# Altium project DEV_board_project.PrjPcb
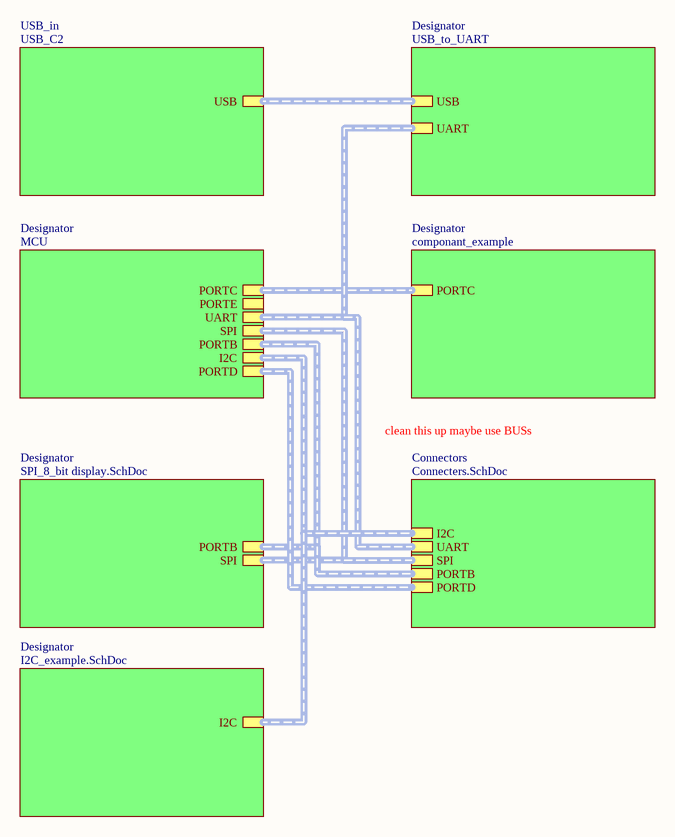
[diagram p0: example connect.SchDoc]
8 sheets, 64 parts. Net scope: hierarchical (ports join the sheet entries above them; power ports are global).
Board file: DEV_board_PCB.PcbDoc
Sheets:
  example connect.SchDoc
    Designator = MCU.SchDoc
    Designator = componant_example.SchDoc
    USB_in = USB_C2.SchDoc
    Designator = USB_to_UART.SchDoc
    Designator = SPI_8_bit display.SchDoc
    Connectors = Connecters.SchDoc
    Designator = I2C_example.SchDoc

## Sheet example connect.SchDoc
size A4; SheetNumber: 1; SheetTotal: 8

### Sub-sheets
Connectors = Connecters.SchDoc: I2C (harness I2C), UART (harness UART), SPI (harness SPI), PORTB (harness PORTB), PORTD (harness PORTD)
Designator = MCU: PORTC (harness PORTC), PORTE (harness PORTE), UART (harness UART), SPI (harness SPI), PORTB (harness PORTB), I2C (harness I2C), PORTD (harness PORTD)
Designator = componant_example: PORTC (harness PORTC)
Designator = USB_to_UART: USB (harness USB), UART (harness UART)
Designator = SPI_8_bit display.SchDoc: SPI (harness SPI), PORTB (harness PORTB)
Designator = I2C_example.SchDoc: I2C (harness I2C)
USB_in = USB_C2: USB (harness USB)

### Buses and harness runs
harness sheet Connectors/I2C = sheet Designator/I2C
harness sheet Connectors/PORTB = sheet Designator/PORTB
harness sheet Connectors/PORTD = sheet Designator/PORTD
harness sheet Connectors/SPI = sheet Designator/SPI
harness sheet Connectors/UART = sheet Designator/UART
harness sheet Designator/USB = sheet USB_in/USB

### Notes on the sheet
- clean this up maybe use BUSs

## Sheet MCU.SchDoc
size A3; SheetNumber: 2; SheetTotal: 8
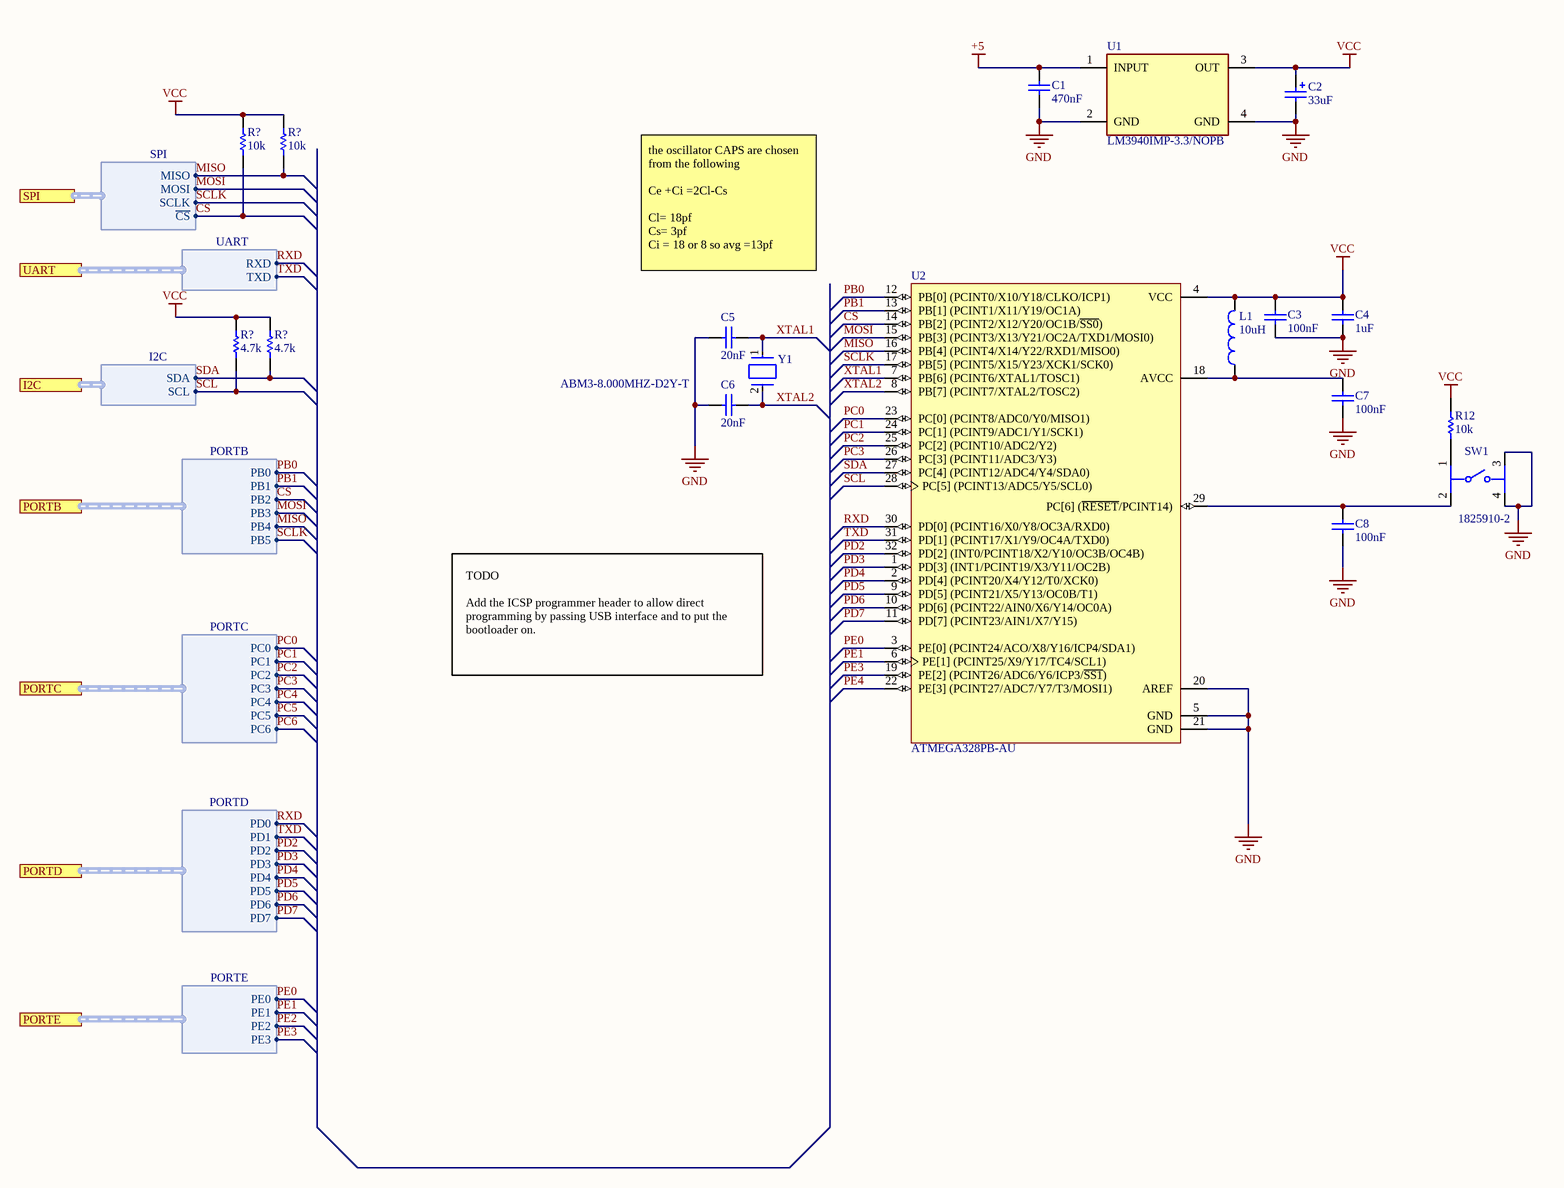
[diagram p1: MCU.SchDoc]

### Parts
(Parts that share a designator on the sheet are numbered #1, #2 ... from top to bottom, then left to right.)
C1  470nF
C2  33uF
C3  100nF
C4  1uF
C5  20nF
C6  20nF
C7  100nF
C8  100nF
L1  10uH  [0402-A]
R12  10k
R?#1  10k
R?#2  10k
R?#3  4.7k
R?#4  4.7k
SW1  1825910-2  [FP-1825910-2-0]
U1  LM3940IMP-3.3/NOPB  [FP-DCY0004A-MFG]
U2  ATMEGA328PB-AU  [ATML-32A_M]
Y1  ABM3-8.000MHZ-D2Y-T  [FP-ABM3-MFG]

### Ports
I2C (harness I2C), PORTB (harness PORTB), PORTC (harness PORTC), PORTD (harness PORTD), PORTE (harness PORTE), SPI (harness SPI), UART (harness UART)

### Harnesses
SPI: MISO, MOSI, SCLK, ~{CS}
UART: RXD, TXD
I2C: SDA, SCL
PORTB: PB0, PB1, PB2, PB3, PB4, PB5
PORTC: PC0, PC1, PC2, PC3, PC4, PC5, PC6
PORTD: PD0, PD1, PD2, PD3, PD4, PD5, PD6, PD7
PORTE: PE0, PE1, PE2, PE3

### Nets
+5: C1.2 U1.1(INPUT)
GND: C1.1 C2.2 C3.1 C4.1 C5.2 C6.2 C7.1 C8.1 SW1.3 SW1.4 U1.2(GND) U1.4(GND) U2.5(GND) U2.20(AREF) U2.21(GND)
VCC: C2.1 C3.2 C4.2 L1.2 R12.2 R?#1.2 R?#2.2 R?#3.2 R?#4.2 U1.3(OUT) U2.4(VCC)
~{CS}: R?#1.1 U2.14(PB[2]_(PCINT2/X12/Y20/OC1B/~{SS0})) ; port SPI.~{CS}
CS: U2.13(PB[1]_(PCINT1/X11/Y19/OC1A)) ; port PORTB.PB1, port PORTB.PB2  [also labelled PB1]
MISO: R?#2.1 U2.16(PB[4]_(PCINT4/X14/Y22/RXD1/MISO0)) ; port SPI.MISO, port PORTB.PB4
MOSI: U2.15(PB[3]_(PCINT3/X13/Y21/OC2A/TXD1/MOSI0)) ; port SPI.MOSI, port PORTB.PB3
PB0: U2.12(PB[0]_(PCINT0/X10/Y18/CLKO/ICP1)) ; port PORTB.PB0  [project net CS]
PC0: U2.23(PC[0]_(PCINT8/ADC0/Y0/MISO1)) ; port PORTC.PC0
PC1: U2.24(PC[1]_(PCINT9/ADC1/Y1/SCK1)) ; port PORTC.PC1
PC2: U2.25(PC[2]_(PCINT10/ADC2/Y2)) ; port PORTC.PC2
PC3: U2.26(PC[3]_(PCINT11/ADC3/Y3)) ; port PORTC.PC3
PC4: port PORTC.PC4
PC5: port PORTC.PC5
PC6: port PORTC.PC6
PD2: U2.32(PD[2]_(INT0/PCINT18/X2/Y10/OC3B/OC4B)) ; port PORTD.PD2
PD3: U2.1(PD[3]_(INT1/PCINT19/X3/Y11/OC2B)) ; port PORTD.PD3
PD4: U2.2(PD[4]_(PCINT20/X4/Y12/T0/XCK0)) ; port PORTD.PD4
PD5: U2.9(PD[5]_(PCINT21/X5/Y13/OC0B/T1)) ; port PORTD.PD5
PD6: U2.10(PD[6]_(PCINT22/AIN0/X6/Y14/OC0A)) ; port PORTD.PD6
PD7: U2.11(PD[7]_(PCINT23/AIN1/X7/Y15)) ; port PORTD.PD7
PE0: U2.3(PE[0]_(PCINT24/ACO/X8/Y16/ICP4/SDA1)) ; port PORTE.PE0
PE1: U2.6(PE[1]_(PCINT25/X9/Y17/TC4/SCL1)) ; port PORTE.PE1
PE2: port PORTE.PE2
PE3: U2.19(PE[2]_(PCINT26/ADC6/Y6/ICP3/~{SS1})) ; port PORTE.PE3
PE4: U2.22(PE[3]_(PCINT27/ADC7/Y7/T3/MOSI1))
RXD: U2.30(PD[0]_(PCINT16/X0/Y8/OC3A/RXD0)) ; port UART.RXD, port PORTD.PD0
SCL: R?#3.1 U2.28(PC[5]_(PCINT13/ADC5/Y5/SCL0)) ; port I2C.SCL
SCLK: U2.17(PB[5]_(PCINT5/X15/Y23/XCK1/SCK0)) ; port SPI.SCLK, port PORTB.PB5
SDA: R?#4.1 U2.27(PC[4]_(PCINT12/ADC4/Y4/SDA0)) ; port I2C.SDA
TXD: U2.31(PD[1]_(PCINT17/X1/Y9/OC4A/TXD0)) ; port UART.TXD, port PORTD.PD1
XTAL1: C5.1 U2.7(PB[6]_(PCINT6/XTAL1/TOSC1)) Y1.1
XTAL2: C6.1 U2.8(PB[7]_(PCINT7/XTAL2/TOSC2)) Y1.2
NetC7_2: C7.2 L1.1 U2.18(AVCC)
NetC8_2: C8.2 SW1.2 U2.29(PC[6]_(~{RESET}/PCINT14))
NetR12_1: R12.1 SW1.1

### Notes on the sheet
- the oscillator CAPS are chosen from the following
  Ce +Ci =2Cl-Cs
  Cl= 18pf
  Cs= 3pf
  Ci = 18 or 8 so avg =13pf
- TODO
  Add the ICSP programmer header to allow direct programming by passing USB interface and to put the bootloader on.

### Library data of the parts
C1 = 470nF: Capacitor; Published: 8-Jun-2000; LatestRevisionDate: 17-Jul-2002; LatestRevisionNote: Re-released for DXP Platform.; PackageReference: RAD-0.3; Publisher: Altium Limited; PackageDescription: Radial Cap, Thru-Hole; 2 Leads; 0.3 in Pin Spacing
C2 = 33uF: Polarized Capacitor; Published: 8-Jun-2000; LatestRevisionDate: 29-May-2009; LatestRevisionNote: IPC-7351 Footprint Added.; PackageReference: C0805; Publisher: Altium Limited; PackageDescription: Chip Capacitor
C3 C7 C8 = 100nF: Capacitor; Published: 8-Jun-2000; LatestRevisionDate: 17-Jul-2002; LatestRevisionNote: Re-released for DXP Platform.; PackageReference: RAD-0.3; Publisher: Altium Limited; PackageDescription: Radial Cap, Thru-Hole; 2 Leads; 0.3 in Pin Spacing
C4 = 1uF: Capacitor; Published: 8-Jun-2000; LatestRevisionDate: 17-Jul-2002; LatestRevisionNote: Re-released for DXP Platform.; PackageReference: RAD-0.3; Publisher: Altium Limited; PackageDescription: Radial Cap, Thru-Hole; 2 Leads; 0.3 in Pin Spacing
C5 C6 = 20nF: Capacitor; Published: 8-Jun-2000; LatestRevisionDate: 17-Jul-2002; LatestRevisionNote: Re-released for DXP Platform.; PackageReference: RAD-0.3; Publisher: Altium Limited; PackageDescription: Radial Cap, Thru-Hole; 2 Leads; 0.3 in Pin Spacing
L1 = 10uH: Inductor; Code_IEC: 1005; Published: 8-Jun-2000; LatestRevisionDate: 29-May-2009; LatestRevisionNote: IPC-7351 Footprint Added.; PackageReference: 0402-A; Publisher: Altium Limited; PackageDescription: Chip Inductor; Code_JEITA: 0402
R12 R?#1 R?#2 = 10k: Resistor; Published: 8-Jun-2000; LatestRevisionDate: 17-Jul-2002; LatestRevisionNote: Re-released for DXP Platform.; PackageReference: AXIAL-0.3; Publisher: Altium Limited; PackageDescription: Axial Device, Thru-Hole; 2 Leads; 0.3 in Pin Spacing
R?#3 R?#4 = 4.7k: 4.7k Resistor; Published: 8-Jun-2000; LatestRevisionDate: 17-Jul-2002; LatestRevisionNote: Re-released for DXP Platform.; PackageReference: AXIAL-0.3; Publisher: Altium Limited; PackageDescription: Axial Device, Thru-Hole; 2 Leads; 0.3 in Pin Spacing
SW1 = CMP-03407-000004-1: SWITCH TACTILE SPST-NO 0.05A 24V; Manufacturer: TE; Contact Current Rating: 50mA; Operating Force: 160gf; Contact Resistance: 100mΩ; Electromechanical Life: 100000Cycles; Package: 0; ComponentLink2Description: Datasheet; Digikey Description: SWITCH TACTILE SPST-NO 0.05A 24V; Octopart: https://octopart.com/1825910-2-te+connectivity-42270502; Temperature Range Low: -35°C; Temperature Range High: +85°C; Lead Free: Yes; Device Class L2: Switches; Automotive: No; Temperature: -35°C to +85°C; Device Class L1: Electromechanical; Category: Switch; ComponentLink2URL: https://www.te.com/commerce/DocumentDelivery/DDEController?Action=showdoc&DocId=Customer+Drawing%7F1825910%7FC10%7Fpdf%7FEnglish%7FENG_CD_1825910_C10.pdf%7F1825910-2; Mount: Through Hole; RoHS: TRUE; Height: 4.6mm; Manufacturer Part Number: 1825910-2; Device Class L3: Tactile Switches; Voltage Rating Dc: 24V; Throw Configuration: SPST-NO
U1 = CMP-0062-01788-4: IC REG LINEAR 3.3V 1A SOT223-4; Min Input Voltage: 4.5V; Max Supply Voltage: 7.5V; Number of Outputs: 1; Output Type: Fixed; Polarity: Positive; Dropout Voltage: 500mV; Quiescent Current: 15mA; Max Output Voltage: 3.3V; Length: 6.5mm; Termination: SMD/SMT; Width: 3.56mm; Min Supply Voltage: 4.5V; Max Output Current: 1A; Case/Package: SOT-223; Output Voltage: 3.3V; Current Rating: 1A; Packaging: Tape and Reel; Lead Free: Lead Free; Nominal Output Voltage: 3.3V; Height: 1.6mm; Series: -; Output Configuration: Positive; Radiation Hardening: No; Number of Regulators: 1; Package Quantity: 1000; REACH SVHC: No SVHC; Max Input Voltage: 7.5V; Max Operating Temperature: 125°C; Min Operating Temperature: -40°C; Output Current: 1A; Contact Plating: Tin; Number of Pins: 4; Mount: Surface Mount
U2 = CMP-2000-07439-1: AVR Microcontroller, 1.8 to 5.5 V, 32 KB Flash, 1 KB EEPROM, 2 KB SRAM, -40 to 85 degC, 32-Pin TQFP (32A), RoHS, Tray; Manufacturer: Microchip; Datasheet URL: http://ww1.microchip.com/downloads/en/DeviceDoc/40001906A.pdf; Mounting Technology: SurfaceMount; RoHSCompliant: false; Manufacturer URL: http://www.microchip.com/; Package Description: 32-Pin Thin Profile Plastic Quad Flat Package, Body 7 x 7 mm, Pitch 0.8 mm; Package Reference: 32A; Datasheet Version: Rev. A, 04/2017
Y1 = CMP-2000-05033-2: Crystal 8MHz ±20ppm 18pF SMD-2 5mm x 3.2mm; Series Resistance: 500R; Frequency Stability: 30ppm; ESR (Equivalent Series Resistance): 140R; Load Capacitance: 18pF; Height: 0.051inch; Tolerance: 20ppm; Depth: 3.2mm; Max Operating Temperature: 85°C; Frequency: 8MHz; Termination: SMD/SMT; Lead Free: Lead Free; Number of Pins: 2; Width: 3.2mm; RoHS Compliant: Yes; Resistor Type: Ceramic; Length: 5mm; Mount: Surface Mount; Case/Package: CSMD; Package Quantity: 1000; Radiation Hardening: No; Min Operating Temperature: -40°C; Packaging: Tape and Reel; Frequency Tolerance: 20ppm

## Sheet componant_example.SchDoc
size A4; SheetNumber: 5; SheetTotal: 8
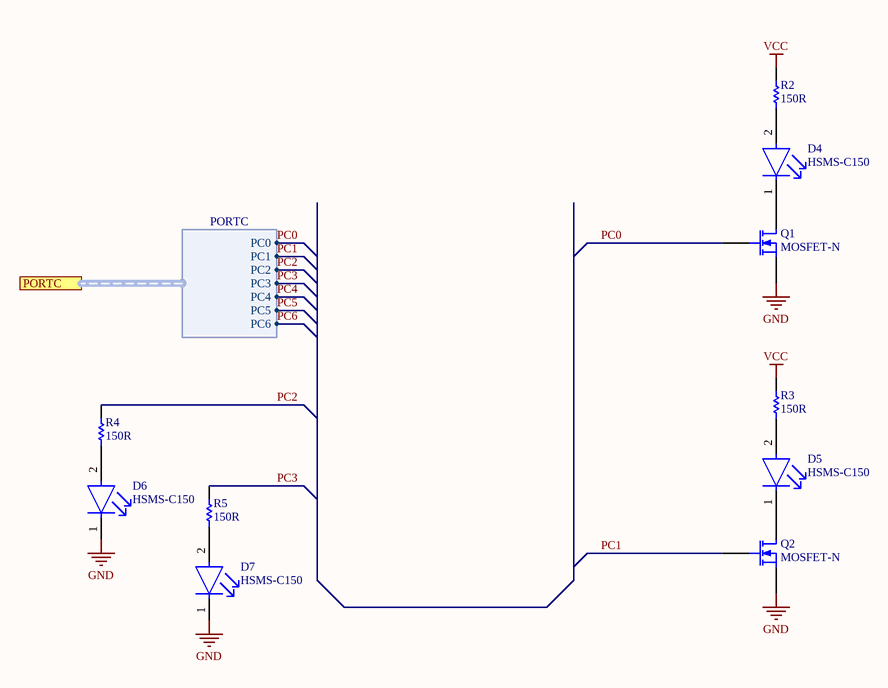
[diagram p2: componant_example.SchDoc]

### Parts
D4  HSMS-C150  [FP-HSMS-C150-MFG]
D5  HSMS-C150  [FP-HSMS-C150-MFG]
D6  HSMS-C150  [FP-HSMS-C150-MFG]
D7  HSMS-C150  [FP-HSMS-C150-MFG]
Q1  MOSFET-N
Q2  MOSFET-N
R2  150R  [RES 0603 SILK]
R3  150R  [RES 0603 SILK]
R4  150R  [RES 0603 SILK]
R5  150R  [RES 0603 SILK]

### Ports
PORTC (harness PORTC)

### Harnesses
PORTC: PC0, PC1, PC2, PC3, PC4, PC5, PC6

### Nets
GND: D6.1(C) D7.1(C) Q1.3(S) Q2.3(S)
VCC: R2.2 R3.2
PC0: Q1.2(G) ; port PORTC.PC0
PC1: Q2.2(G) ; port PORTC.PC1
PC2: R4.2 ; port PORTC.PC2
PC3: R5.2 ; port PORTC.PC3
PC4: port PORTC.PC4
PC5: port PORTC.PC5
PC6: port PORTC.PC6
NetD4_1: D4.1(C) Q1.1(D)
NetD4_2: D4.2(A) R2.1
NetD5_1: D5.1(C) Q2.1(D)
NetD5_2: D5.2(A) R3.1
NetD6_2: D6.2(A) R4.1
NetD7_2: D7.2(A) R5.1

### Library data of the parts
D4-D7 = CMP-21615-000001-1: LED RED DIFFUSED CHIP SMD; Luminous Intensity: 10mcd; Power Dissipation: 65mW; Viewing Angle: 170°; Number of Elements: 1; Forward Current: 20mA; Lens Color: White; Lens Style: Rectangular; Wavelength: 626nm; Forward Voltage: 2.1V; Reverse Voltage: 5V; Number of Pins: 2; Color: Red; Lead Free: Lead Free; Width: 1.6mm; Length: 3.2mm; REACH SVHC: No SVHC; Height: 1.1mm; Depth: 1.6mm; Power Rating: 65mW; Package Quantity: 1; Illumination Color: Red; Radiation Hardening: No; Case Code (Imperial): 1206; Max Operating Temperature: 85°C; Test Current: 20mA; Case/Package: 1206; Lens Transparency: Diffused; Number of LEDs: 1; Packaging: Tape and Reel; Mount: Surface Mount; Min Operating Temperature: -40°C; Case Code (Metric): 3216; Dominant Wavelength: 626nm
Q1 Q2 = 2N7002: N-Channel MOSFET / 2N7002,215 (SOT23) package; Published: 8-Jun-2000; LatestRevisionDate: 17-Jul-2002; LatestRevisionNote: Re-released for DXP Platform.; PackageVersion: 1995/1996; PackageReference: E3; Publisher: Altium Limited; PackageDescription: TO, Flat Index; 3 In-Line, Axial Leads; Body Dia. 4.6mm; Lead Dia. 0.5 mm (max)
R2-R5 = 150R: Resistor; Published: 8-Jun-2000; LatestRevisionDate: 17-Jul-2002; LatestRevisionNote: Re-released for DXP Platform.; PackageReference: AXIAL-0.3; Publisher: Altium Limited; PackageDescription: Axial Device, Thru-Hole; 2 Leads; 0.3 in Pin Spacing

## Sheet USB_C2.SchDoc
size A4; SheetNumber: 5; SheetTotal: 8
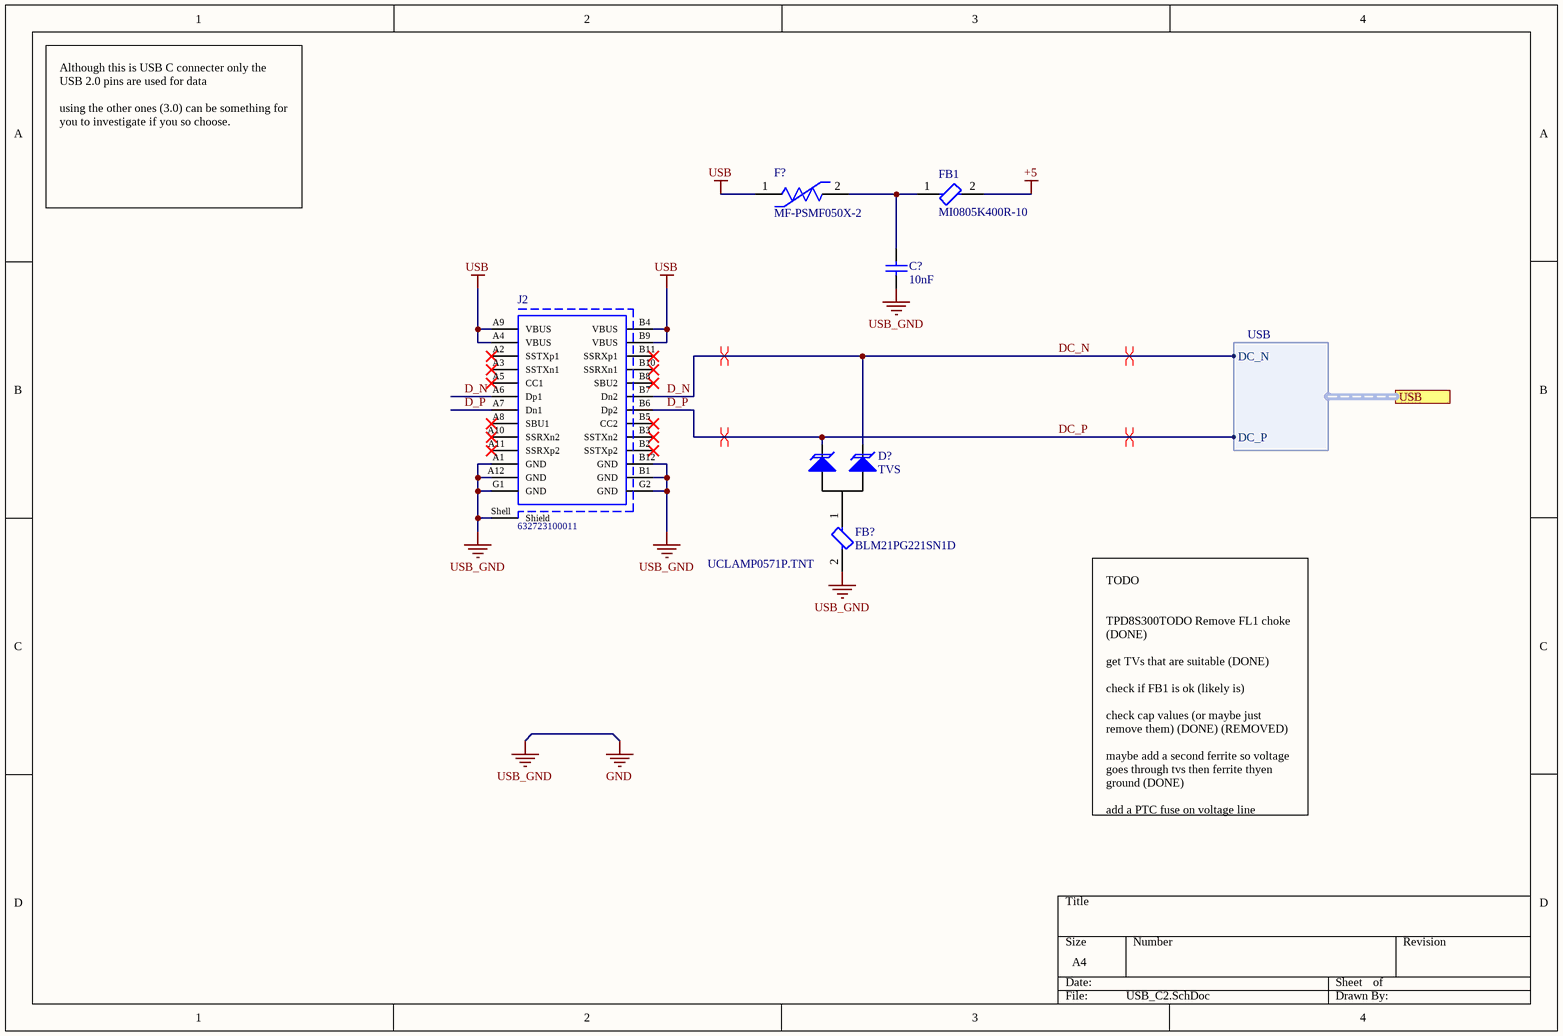
[diagram p3: USB_C2.SchDoc]

### Parts
(Parts that share a designator on the sheet are numbered #1, #2 ... from top to bottom, then left to right.)
C?#1  10nF
D?  TVS  [SOT50P160X90-3N]
F?  MF-PSMF050X-2  [FP-MF-PSMF-MFG]
FB1  MI0805K400R-10  [FP-MI0805-MFG]
FB?  BLM21PG221SN1D  [FP-BLM21-0_2-t0_85-e0_5-IPC_B]
J2  632723100011  [632723100011]

### Ports
USB (harness USB)

### Harnesses
USB: DC_N, DC_P

### Nets
+5: FB1.2
GND: C?#1.1 FB?.2 J2.A1(GND) J2.A12(GND) J2.B1(GND) J2.B12(GND) J2.G1(GND) J2.G2(GND) J2.Shell(Shield)  [also labelled USB_GND]
USB: F?.1 J2.A4(VBUS) J2.A9(VBUS) J2.B4(VBUS) J2.B9(VBUS)
D_N: D?.1 J2.A6(Dp1) J2.B7(Dn2) ; port USB.DC_N  [also labelled DC_N]
D_P: D?.2 J2.A7(Dn1) J2.B6(Dp2) ; port USB.DC_P  [also labelled DC_P]
NetC?#1_2: C?#1.2 F?.2 FB1.1
NetD?_3: D?.3 FB?.1

Not connected (* = marked no-connect by the designer): J2 A2(SSTXp1)* A3(SSTXn1)* A5(CC1)* A8(SBU1)* A10(SSRXn2)* A11(SSRXp2)* B2(SSTXp2)* B3(SSTXn2)* B5(CC2)* B8(SBU2)* B10(SSRXn1)* B11(SSRXp1)*

### Layout directives
differential pair: D_N, D_P

### Notes on the sheet
- Although this is USB C connecter only the USB 2.0 pins are used for data
  using the other ones (3.0) can be something for you to investigate if you so choose.
- UCLAMP0571P.TNT
- TODO
  TPD8S300TODO Remove FL1 choke (DONE)
  get TVs that are suitable (DONE)
  check if FB1 is ok (likely is)
  check cap values (or maybe just remove them) (DONE) (REMOVED)
  maybe add a second ferrite so voltage goes through tvs then ferrite thyen ground (DONE)
  add a PTC fuse on voltage line (DONE)

### Library data of the parts
C?#1 = 10nF: 10nF ceramic Capacitor / (USB 5V smoothing cap); Published: 8-Jun-2000; LatestRevisionDate: 17-Jul-2002; LatestRevisionNote: Re-released for DXP Platform.; PackageReference: RAD-0.3; Publisher: Altium Limited; PackageDescription: Radial Cap, Thru-Hole; 2 Leads; 0.3 in Pin Spacing
D? = TVS combined: dual TVS diode for USB 2.0 protection / RCLAMP0582BQTCT; Supplier 1: Digi-Key; Supplier 2: Digi-Key; Supplier 3: Digi-Key; Supplier 4: Mouser; Supplier Part Number 1: RCLAMP0582BQTCTCT-ND; Supplier Part Number 2: RCLAMP0582BQTCTDKR-ND; Supplier Part Number 3: RCLAMP0582BQTCTTR-ND; Supplier Part Number 4: 947-RCLAMP0582BQTCT
F? = CMP-07400-000013-1: PTC RESET FUSE 6V 500MA 0805; Manufacturer: Bourns Inc.; Trip Current: 1A; Trip Time: 0.1s; Value: 0.15-0.9Ω; Hold Current: 0.5A; Current Rating: 40A; Category: Fuse; Temperature: -40°C to +85°C; ComponentLink2Description: Datasheet; Manufacturer Part Number: MF-PSMF050X-2; Temperature Range High: +85°C; Package: MF-PSMF; Device Class L1: Circuit Protection; Lead Free: Yes; ComponentLink2URL: https://www.bourns.com/docs/product-datasheets/mfpsmf.pdf?sfvrsn=9c05cafe_24; Ambient Temperature Range Low: -40°C; Mouser Description: Resettable Fuses - PPTC .50A 6V 0.15ohm Hold .5 Trip 1; Resistance: 0.15-0.9Ω; Automotive: Yes; Ambient Temperature Range High: +85°C; Device Class L2: PTC Resettable Fuses; Temperature Range Low: -40°C; Device Class L3: unset; Octopart: https://octopart.com/mf-psmf050x-2-bourns-7483438; Digikey Description: PTC RESET FUSE 6V 500MA 0805; Height: 0.85mm; RoHS: TRUE; Voltage Rating: 6V
FB1 = CMP-2000-06702-2: FERRITE BEAD 40 OHM 0805 1LN; Impedance: 40R; Max Current Rating: 1.5A; Tolerance: 25%; Test Frequency: 100MHz; DC Resistance (DCR): 50mR; Number of Lines: 1; Min Operating Temperature: -40°C; Case/Package: 0805; Depth: 1.45mm; Current Rating: 1.5A; Width: 0.049inch; Core Material: Ferrite; Termination: SMD/SMT; Case Code (Imperial): 0805; Packaging: Tape and Reel; Weight: 0.00392oz; Lead Free: Lead Free; Length: 2mm; Max Operating Temperature: 125°C; Mount: Surface Mount; Case Code (Metric): 2012; Frequency: 100MHz; Height: 0.043inch; Package Quantity: 1; Material: Ferrite; Contact Plating: Tin; Max DC Current: 1.5A
FB? = CMP-0686-00610-3: Chip Ferrite Bead, 0805, 220Ω @ 100MHz, 0.045Ω, 25%, 2A; Number of Circuits: 1; Shielding: Unshielded; DC Resistance (DCR): 45mR; Impedance: 220R; Radiation Hardening: No; Material: Ferrite; Frequency: 100MHz; Width: 1.25mm; DC Current: 2A; Max DC Current: 2A; Number of Lines: 1; Package Quantity: 1; Case Code (Metric): 2012; Current Rating: 2A; Case/Package: 0805; Current: 2A; Military Standard: Not; Core Material: Ferrite; Depth: 1.25mm; Contact Plating: Tin; DC Resistance-Max: 45mR; Max Operating Temperature: 125°C; Length: 2mm; Max Current Rating: 2A; REACH SVHC: No SVHC; Termination: SMD/SMT; Min Operating Temperature: -55°C; Series: BLM21P; Test Frequency: 100MHz; Tolerance: 25%; Number of Pins: 2; RoHS Compliant: Yes; Height: 0.85mm; Packaging: Tape and Reel; Lead Free: Lead Free; Case Code (Imperial): 0805
J2 = CMP-1502-03213-1: USB 3.1 Type C Receptacle WR-COM, Horizontal, SMT / THT; Manufacturer: Wurth Elektronik; Working Voltage: 20VDC; Rated Current: 5A; Contact Resistance: 30mOhm; Operating Temperature: -40to105degC; Publisher: WurthElektronik; Gender: Receptacle; Part Number: 632723100011; Mounting Technology: SMT/THT; Datasheet URL: https://katalog.we-online.de/em/datasheet/632723x00011%282%29.pdf; Connector Type: USB3.1TypeC; Manufacturer URL: http://www.we-online.de; Orientation: Horizontal; Package Reference: 632723100011; Packaging: TapeandReel

## Sheet USB_to_UART.SchDoc
size A4; SheetNumber: 6; SheetTotal: 8
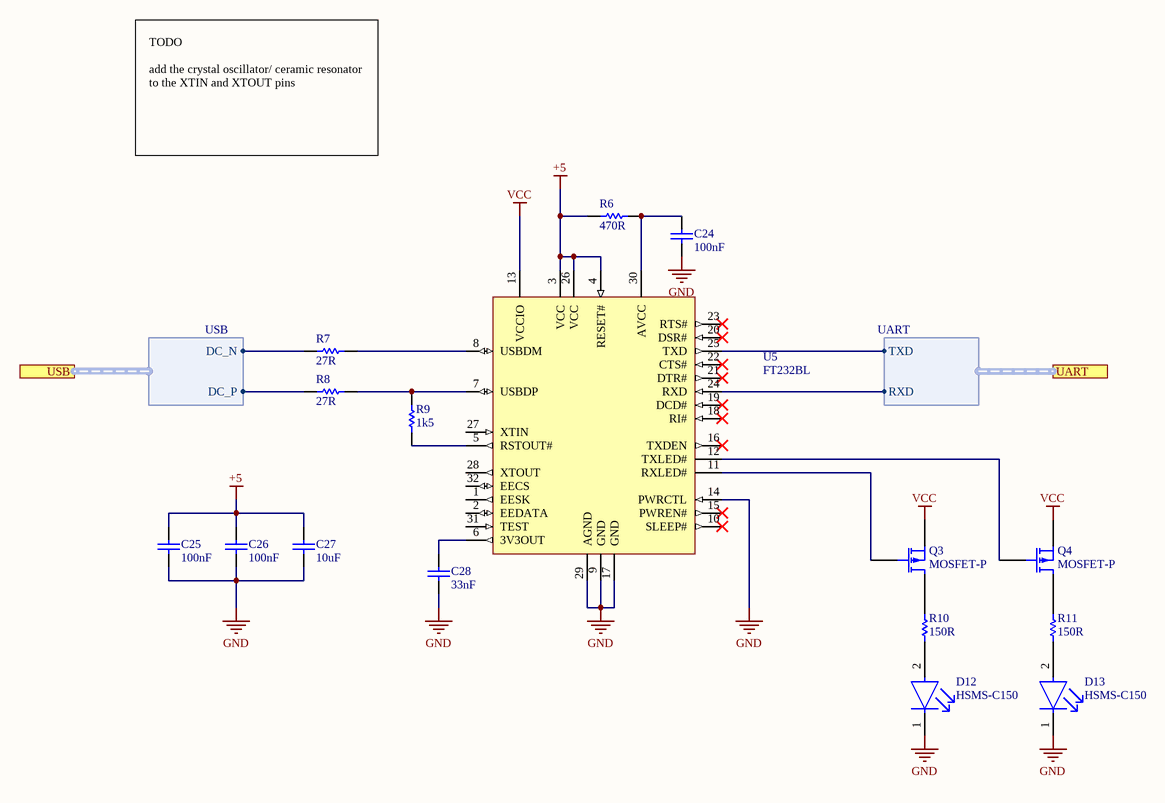
[diagram p4: USB_to_UART.SchDoc]

### Parts
C24  100nF
C25  100nF
C26  100nF
C27  10uF
C28  33nF
D12  HSMS-C150  [FP-HSMS-C150-MFG]
D13  HSMS-C150  [FP-HSMS-C150-MFG]
Q3  MOSFET-P  [Tran SOT23]
Q4  MOSFET-P  [Tran SOT23]
R6  470R
R7  27R
R8  27R
R9  1k5
R10  150R  [RES 0603 SILK]
R11  150R  [RES 0603 SILK]
U5  FT232BL  [LQFP-32_L]

### Ports
UART (harness UART), USB (harness USB)

### Harnesses
USB: DC_N, DC_P
UART: RXD, TXD

### Nets
+5: C25.2 C26.2 C27.2 R6.1 U5.3(VCC) U5.4(RESET#) U5.26(VCC)
GND: C24.1 C25.1 C26.1 C27.1 C28.1 D12.1(C) D13.1(C) U5.9(GND) U5.14(PWRCTL) U5.17(GND) U5.29(AGND)
VCC: Q3.2(S) Q4.2(S) U5.13(VCCIO)
D_N: R7.1 ; port USB.DC_N
D_P: R8.1 ; port USB.DC_P
RXD: U5.24(RXD) ; port UART.RXD
TXD: U5.25(TXD) ; port UART.TXD
NetC24_2: C24.2 R6.2 U5.30(AVCC)
NetC28_2: C28.2 U5.6(3V3OUT)
NetD12_2: D12.2(A) R10.1
NetD13_2: D13.2(A) R11.1
NetQ3_1: Q3.1(G) U5.11(RXLED#)
NetQ3_3: Q3.3(D) R10.2
NetQ4_1: Q4.1(G) U5.12(TXLED#)
NetQ4_3: Q4.3(D) R11.2
NetR7_2: R7.2 U5.8(USBDM)
NetR8_2: R8.2 R9.2 U5.7(USBDP)
NetR9_1: R9.1 U5.5(RSTOUT#)

Not connected (* = marked no-connect by the designer): U5 1(EESK) 2(EEDATA) 10(SLEEP#)* 15(PWREN#)* 16(TXDEN)* 18(RI#)* 19(DCD#)* 20(DSR#)* 21(DTR#)* 22(CTS#)* 23(RTS#)* 27(XTIN) 28(XTOUT) 31(TEST) 32(EECS)

### Notes on the sheet
- TODO
  add the crystal oscillator/ ceramic resonator to the XTIN and XTOUT pins

### Library data of the parts
C24-C26 = 100nF: Capacitor; Published: 8-Jun-2000; LatestRevisionDate: 17-Jul-2002; LatestRevisionNote: Re-released for DXP Platform.; PackageReference: RAD-0.3; Publisher: Altium Limited; PackageDescription: Radial Cap, Thru-Hole; 2 Leads; 0.3 in Pin Spacing
C27 = 10uF: 10uF ceramic Capacitor; Published: 8-Jun-2000; LatestRevisionDate: 17-Jul-2002; LatestRevisionNote: Re-released for DXP Platform.; PackageReference: RAD-0.3; Publisher: Altium Limited; PackageDescription: Radial Cap, Thru-Hole; 2 Leads; 0.3 in Pin Spacing
C28 = 33nF: 33nF ceramic Capacitor; Published: 8-Jun-2000; LatestRevisionDate: 17-Jul-2002; LatestRevisionNote: Re-released for DXP Platform.; PackageReference: RAD-0.3; Publisher: Altium Limited; PackageDescription: Radial Cap, Thru-Hole; 2 Leads; 0.3 in Pin Spacing
D12 D13 = CMP-21615-000001-1: as D4 on sheet componant_example; Number of Pins: 2; Color: Red; Lead Free: Lead Free; Width: 1.6mm; Length: 3.2mm; REACH SVHC: No SVHC; Height: 1.1mm; Depth: 1.6mm; Power Rating: 65mW; Package Quantity: 1; Illumination Color: Red; Radiation Hardening: No; Case Code (Imperial): 1206; Max Operating Temperature: 85°C; Test Current: 20mA; Case/Package: 1206; Lens Transparency: Diffused; Number of LEDs: 1; Packaging: Tape and Reel; Mount: Surface Mount; Min Operating Temperature: -40°C; Case Code (Metric): 3216; Dominant Wavelength: 626nm
Q3 Q4 = MOSFET-P: P-Channel MOSFET; Published: 8-Jun-2000; LatestRevisionDate: 17-Jul-2002; LatestRevisionNote: Re-released for DXP Platform.; PackageVersion: 1995/1996; PackageReference: E3; Publisher: Altium Limited; PackageDescription: TO, Flat Index; 3 In-Line, Axial Leads; Body Dia. 4.6mm; Lead Dia. 0.5 mm (max)
R6 = 470R: 470 ohm Resistor; Published: 8-Jun-2000; LatestRevisionDate: 17-Jul-2002; LatestRevisionNote: Re-released for DXP Platform.; PackageReference: AXIAL-0.3; Publisher: Altium Limited; PackageDescription: Axial Device, Thru-Hole; 2 Leads; 0.3 in Pin Spacing
R7 R8 = 27R: Resistor; Published: 8-Jun-2000; LatestRevisionDate: 17-Jul-2002; LatestRevisionNote: Re-released for DXP Platform.; PackageReference: AXIAL-0.3; Publisher: Altium Limited; PackageDescription: Axial Device, Thru-Hole; 2 Leads; 0.3 in Pin Spacing
R9 = 1k5: Resistor; Published: 8-Jun-2000; LatestRevisionDate: 17-Jul-2002; LatestRevisionNote: Re-released for DXP Platform.; PackageReference: AXIAL-0.3; Publisher: Altium Limited; PackageDescription: Axial Device, Thru-Hole; 2 Leads; 0.3 in Pin Spacing
R10 R11 = 150R: Resistor; Published: 8-Jun-2000; LatestRevisionDate: 17-Jul-2002; LatestRevisionNote: Re-released for DXP Platform.; PackageReference: AXIAL-0.3; Publisher: Altium Limited; PackageDescription: Axial Device, Thru-Hole; 2 Leads; 0.3 in Pin Spacing
U5 = CMP-0078-00024-3: USB UART Asynchronous Serial Data Transfer Chip, 0 to +70 degC, 32-pin LQFP, Pb-Free; Manufacturer: FTDI; DatasheetVersion: ver 2.2, Nov-2011; ComponentLink2URL: http://www.ftdichip.com/Support/Documents/DataSheets/ICs/DS_FT232BL_BQ.pdf; ComponentLink1Description: Manufacturer URL; PackageVersion: Nov-11; PackageDescription: 32-Pin Thin Quad Flat Pack, 7 x 7 mm Body, 0.8 mm Pitch; PackageReference: LQFP-32; PartNumber: FT232BL; ComponentLink2Description: Datasheet; ComponentLink1URL: http://www.ftdichip.com/

## Sheet SPI_8_bit display.SchDoc
size A4; SheetNumber: 4; SheetTotal: 7
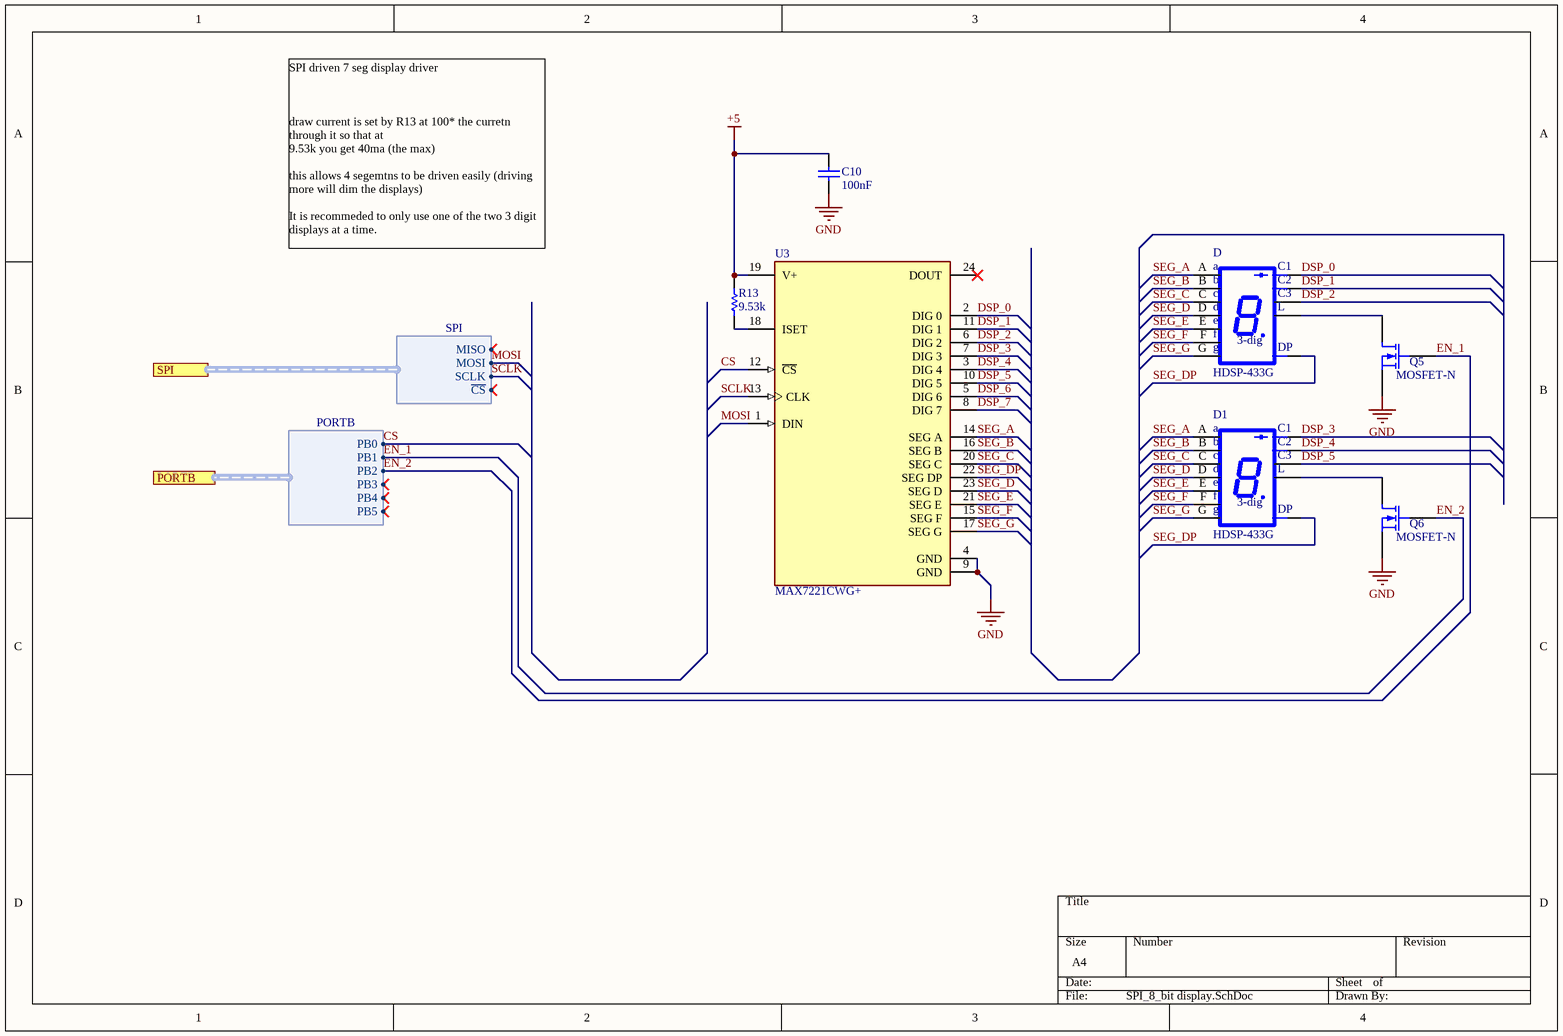
[diagram p5: SPI_8_bit display.SchDoc]

### Parts
C10  100nF
D  HDSP-433G  [HDSP-433G]
D1  HDSP-433G  [HDSP-433G]
Q5  MOSFET-N
Q6  MOSFET-N
R13  9.53k
U3  MAX7221CWG+  [FP-W24-1-MFG]

### Ports
PORTB (harness PORTB), SPI (harness SPI)

### Harnesses
SPI: MISO, MOSI, SCLK, ~{CS}
PORTB: PB0, PB1, PB2, PB3, PB4, PB5

### Nets
+5: C10.2 R13.2 U3.19(V+)
GND: C10.1 Q5.3(S) Q6.3(S) U3.4(GND) U3.9(GND)
CS: U3.12(~{CS}) ; port PORTB.PB0
DSP_0: D.D1(C1) U3.2(DIG_0)
DSP_1: D.D2(C2) U3.11(DIG_1)
DSP_2: D.D3(C3) U3.6(DIG_2)
DSP_3: D1.D1(C1) U3.7(DIG_3)
DSP_4: D1.D2(C2) U3.3(DIG_4)
DSP_5: D1.D3(C3) U3.10(DIG_5)
DSP_6: U3.5(DIG_6)
DSP_7: U3.8(DIG_7)
EN_1: Q5.2(G) Q6.2(G) ; port PORTB.PB1, port PORTB.PB2  [also labelled EN_2]  [project net CS]
MISO: port SPI.MISO, port PORTB.PB4
MOSI: U3.1(DIN) ; port SPI.MOSI, port PORTB.PB3
SCLK: U3.13(CLK) ; port SPI.SCLK, port PORTB.PB5
SEG_A: D.A D1.A U3.14(SEG_A)
SEG_B: D.B D1.B U3.16(SEG_B)
SEG_C: D.C D1.C U3.20(SEG_C)
SEG_D: D.D D1.D U3.23(SEG_D)
SEG_DP: D.DP D1.DP U3.22(SEG_DP)
SEG_E: D.E D1.E U3.21(SEG_E)
SEG_F: D.F D1.F U3.15(SEG_F)
SEG_G: D.G D1.G U3.17(SEG_G)
NetD1_L: D1.L(P$1) Q6.1(D)
NetD_L: D.L(P$1) Q5.1(D)
NetR13_1: R13.1 U3.18(ISET)

Not connected (* = marked no-connect by the designer): U3 24(DOUT)*

### Notes on the sheet
- SPI driven 7 seg display driver
  draw current is set by R13 at 100* the curretn through it so that at
  9.53k you get 40ma (the max)
  this allows 4 segemtns to be driven easily (driving more will dim the displays)
  It is recommeded to only use one of the two 3 digit displays at a time.
- (in symbol HDSP-433G) a; b; c; d; e; f; 3-dig; g

### Library data of the parts
C10 = 100nF: Capacitor; Published: 8-Jun-2000; LatestRevisionDate: 17-Jul-2002; LatestRevisionNote: Re-released for DXP Platform.; PackageReference: RAD-0.3; Publisher: Altium Limited; PackageDescription: Radial Cap, Thru-Hole; 2 Leads; 0.3 in Pin Spacing
D D1 = HDSP-433G: Display Modules - LED Character and Numeric Green 7-Segment 3 Character Common Cathode 2.25V 20mA 0.504 H x 1.182 W x 0.276 D _12.80mm x 30.02mm x 7.00mm_ 15-DIP _0.400, 10.16mm_, 12 Leads; MF: Broadcom Limited; Package: DIP-15 Broadcom; MP: HDSP-433G; Digi-Key_Purchase_URL: https://www.digikey.com/product-detail/en/broadcom-limited/HDSP-433G/516-3125-ND/2219091?utm_source=snapeda&utm_medium=aggregator&utm_campaign=symbol; Value: *; Digi-Key_Part_Number: 516-3125-ND; SnapEDA_Link: https://www.snapeda.com/parts/HDSP-433G/Broadcom%20Limited/view-part/1760683/?ref=snap
Q5 Q6 = 2N7002: as Q1 on sheet componant_example; Published: 8-Jun-2000; LatestRevisionDate: 17-Jul-2002; LatestRevisionNote: Re-released for DXP Platform.; PackageVersion: 1995/1996; PackageReference: E3; Publisher: Altium Limited; PackageDescription: TO, Flat Index; 3 In-Line, Axial Leads; Body Dia. 4.6mm; Lead Dia. 0.5 mm (max)
R13 = 9.53k: Resistor; Published: 8-Jun-2000; LatestRevisionDate: 17-Jul-2002; LatestRevisionNote: Re-released for DXP Platform.; PackageReference: AXIAL-0.3; Publisher: Altium Limited; PackageDescription: Axial Device, Thru-Hole; 2 Leads; 0.3 in Pin Spacing
U3 = CMP-05718-000002-1: IC DRVR 7 SEGMNT 8 DIGIT 24SOIC; Manufacturer: Maxim Integrated; Nominal Supply Current: 330mA; Max Power Dissipation: 941mW; Standoff Height: 0.1mm; Min Supply Voltage: 4V; Max Supply Voltage: 5.5V; Max Junction Temp: +150°C; Number Of Outputs: 8; Lead Free: Yes; Device Class L2: Power Management ICs; Height: 2.65mm; Temperature: 0°C to +70°C; Category: IC; Ipc Land Pattern Name: SOIC127P1032X250-24; Temperature Range High: +70°C; Package: W24-1; Manufacturer Part Number: MAX7221CWG+; Device Class L3: LED Drivers; ComponentLink2URL: https://datasheets.maximintegrated.com/en/ds/MAX7219-MAX7221.pdf; Temperature Range Low: 0°C; Device Class L1: Integrated Circuits (ICs); ComponentLink2Description: Datasheet; Digikey Description: IC DRVR 7 SEGMNT 8 DIGIT 24SOIC; Mouser Description: In a Tube of 30, Maxim MAX7221CWG+, LED Driver, 8-Digits 64-Segments, 5 V, 24-Pin SOIC W; RoHS: TRUE; Octopart: https://octopart.com/max7221cwg%2B-maxim+integrated-39581478; Automotive: No; Footprint Url: https://pdfserv.maximintegrated.com/land_patterns/90-0182.PDF

## Sheet Connecters.SchDoc
size A3; SheetNumber: 7; SheetTotal: 7
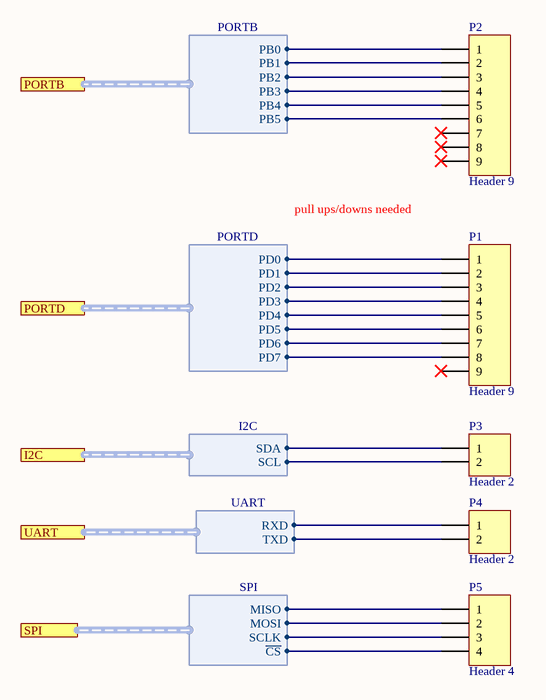
[diagram p6: Connecters.SchDoc]

### Parts
P1  Header 9  [HDR1X9]
P2  Header 9  [HDR1X9]
P3  Header 2  [HDR1X2]
P4  Header 2  [HDR1X2]
P5  Header 4  [HDR1X4]

### Ports
I2C (harness I2C), PORTB (harness PORTB), PORTD (harness PORTD), SPI (harness SPI), UART (harness UART)

### Harnesses
PORTB: PB0, PB1, PB2, PB3, PB4, PB5
PORTD: PD0, PD1, PD2, PD3, PD4, PD5, PD6, PD7
I2C: SDA, SCL
UART: RXD, TXD
SPI: MISO, MOSI, SCLK, ~{CS}

### Nets
~{CS}: P5.4 ; port SPI.~{CS}
CS: P2.1 ; port PORTB.PB0
CS: P2.2 P2.3 ; port PORTB.PB1, port PORTB.PB2  [a separate net that carries the same name]
MISO: P2.5 P5.1 ; port PORTB.PB4, port SPI.MISO
MOSI: P2.4 P5.2 ; port PORTB.PB3, port SPI.MOSI
PD2: P1.3 ; port PORTD.PD2
PD3: P1.4 ; port PORTD.PD3
PD4: P1.5 ; port PORTD.PD4
PD5: P1.6 ; port PORTD.PD5
PD6: P1.7 ; port PORTD.PD6
PD7: P1.8 ; port PORTD.PD7
RXD: P1.1 P4.1 ; port PORTD.PD0, port UART.RXD
SCL: P3.2 ; port I2C.SCL
SCLK: P2.6 P5.3 ; port PORTB.PB5, port SPI.SCLK
SDA: P3.1 ; port I2C.SDA
TXD: P1.2 P4.2 ; port PORTD.PD1, port UART.TXD

Not connected (* = marked no-connect by the designer): P1 9*; P2 7* 8* 9*

### Notes on the sheet
- pull ups/downs needed

### Library data of the parts
P1 P2 = Header 9: Header, 9-Pin; LatestRevisionDate: 17-Jul-2002; LatestRevisionNote: Re-released for DXP Platform.; Publisher: Altium Limited
P3 P4 = Header 2: Header, 2-Pin; LatestRevisionDate: 17-Jul-2002; LatestRevisionNote: Re-released for DXP Platform.; Publisher: Altium Limited
P5 = Header 4: Header, 4-Pin; LatestRevisionDate: 17-Jul-2002; LatestRevisionNote: Re-released for DXP Platform.; Publisher: Altium Limited

## Sheet I2C_example.SchDoc
size A3; SheetNumber: 8; SheetTotal: 8
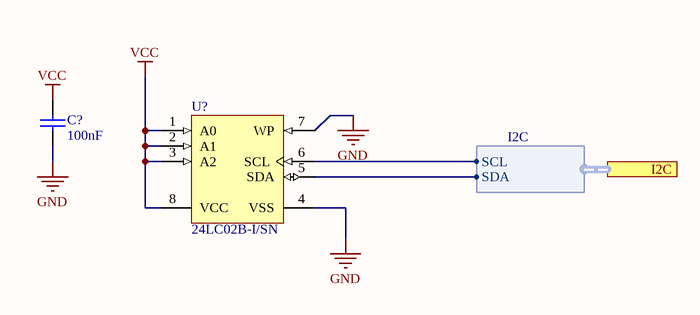
[diagram p7: I2C_example.SchDoc]

### Parts
(Parts that share a designator on the sheet are numbered #1, #2 ... from top to bottom, then left to right.)
C?#2  100nF
U?  24LC02B-I/SN  [SOIC-SN8_N]

### Ports
I2C (harness I2C)

### Harnesses
I2C: SDA, SCL

### Nets
GND: C?#2.1 U?.4(VSS) U?.7(WP)
VCC: C?#2.2 U?.1(A0) U?.2(A1) U?.3(A2) U?.8(VCC)
SCL: U?.6(SCL) ; port I2C.SCL
SDA: U?.5(SDA) ; port I2C.SDA

### Library data of the parts
C?#2 = 100nF: Capacitor; Published: 8-Jun-2000; LatestRevisionDate: 17-Jul-2002; LatestRevisionNote: Re-released for DXP Platform.; PackageReference: RAD-0.3; Publisher: Altium Limited; PackageDescription: Radial Cap, Thru-Hole; 2 Leads; 0.3 in Pin Spacing
U? = CMP-0159-00332-1: 2Kbit, 400kHz, 2.5V, I2C Serial EEPROM, 8-Pin SOIC 150mil, Industrial Temperature; PackageReference: SOIC-SN8; Code_JEDEC: MS-012; DatasheetVersion: revJ, Feb-2009; Code_IPC: SOIC127P600-8; PackageVersion: revBB, Aug-2009; PackageDescription: 8-Lead Plastic Small Outline (SN) - Narrow, 3.90mm Body [SOIC]

## Nets that join several sheets
+5: MCU (C1.2 U1.1), USB_C2 (FB1.2), USB_to_UART (7 pins), SPI_8_bit display (C10.2 R13.2 U3.19)
GND: MCU (15 pins), componant_example (D6.1 D7.1 Q1.3 Q2.3), USB_C2 (9 pins), USB_to_UART (11 pins), SPI_8_bit display (5 pins), I2C_example (C?#2.1 U?.4 U?.7)
VCC: MCU (11 pins), componant_example (R2.2 R3.2), USB_to_UART (Q3.2 Q4.2 U5.13), I2C_example (5 pins)
~{CS}: MCU (R?#1.1 U2.14), Connecters (P5.4)
CS: MCU (U2.12), SPI_8_bit display (U3.12), Connecters (P2.1)
CS: MCU (U2.13), SPI_8_bit display (Q5.2 Q6.2), Connecters (P2.2 P2.3)
D_N: USB_C2 (D?.1 J2.A6 J2.B7), USB_to_UART (R7.1)
D_P: USB_C2 (D?.2 J2.A7 J2.B6), USB_to_UART (R8.1)
MISO: MCU (R?#2.1 U2.16), Connecters (P2.5 P5.1)
MOSI: MCU (U2.15), SPI_8_bit display (U3.1), Connecters (P2.4 P5.2)
PC0: MCU (U2.23), componant_example (Q1.2)
PC1: MCU (U2.24), componant_example (Q2.2)
PC2: MCU (U2.25), componant_example (R4.2)
PC3: MCU (U2.26), componant_example (R5.2)
PD2: MCU (U2.32), Connecters (P1.3)
PD3: MCU (U2.1), Connecters (P1.4)
PD4: MCU (U2.2), Connecters (P1.5)
PD5: MCU (U2.9), Connecters (P1.6)
PD6: MCU (U2.10), Connecters (P1.7)
PD7: MCU (U2.11), Connecters (P1.8)
RXD: MCU (U2.30), USB_to_UART (U5.24), Connecters (P1.1 P4.1)
SCL: MCU (R?#3.1 U2.28), Connecters (P3.2), I2C_example (U?.6)
SCLK: MCU (U2.17), SPI_8_bit display (U3.13), Connecters (P2.6 P5.3)
SDA: MCU (R?#4.1 U2.27), Connecters (P3.1), I2C_example (U?.5)
TXD: MCU (U2.31), USB_to_UART (U5.25), Connecters (P1.2 P4.2)